# Altium schematic sheet Top Level - BlackChat.SchDoc
size Letter
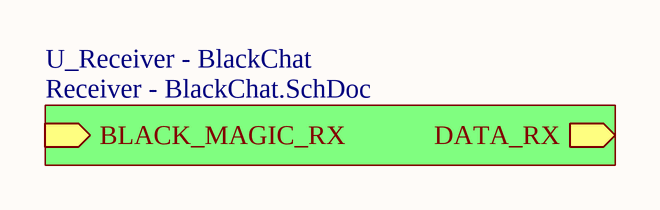
[diagram p0: Top Level - BlackChat.SchDoc]

## Sub-sheets
U_Receiver - BlackChat = Receiver - BlackChat.SchDoc: DATA_RX (out), BLACK_MAGIC_RX (in)